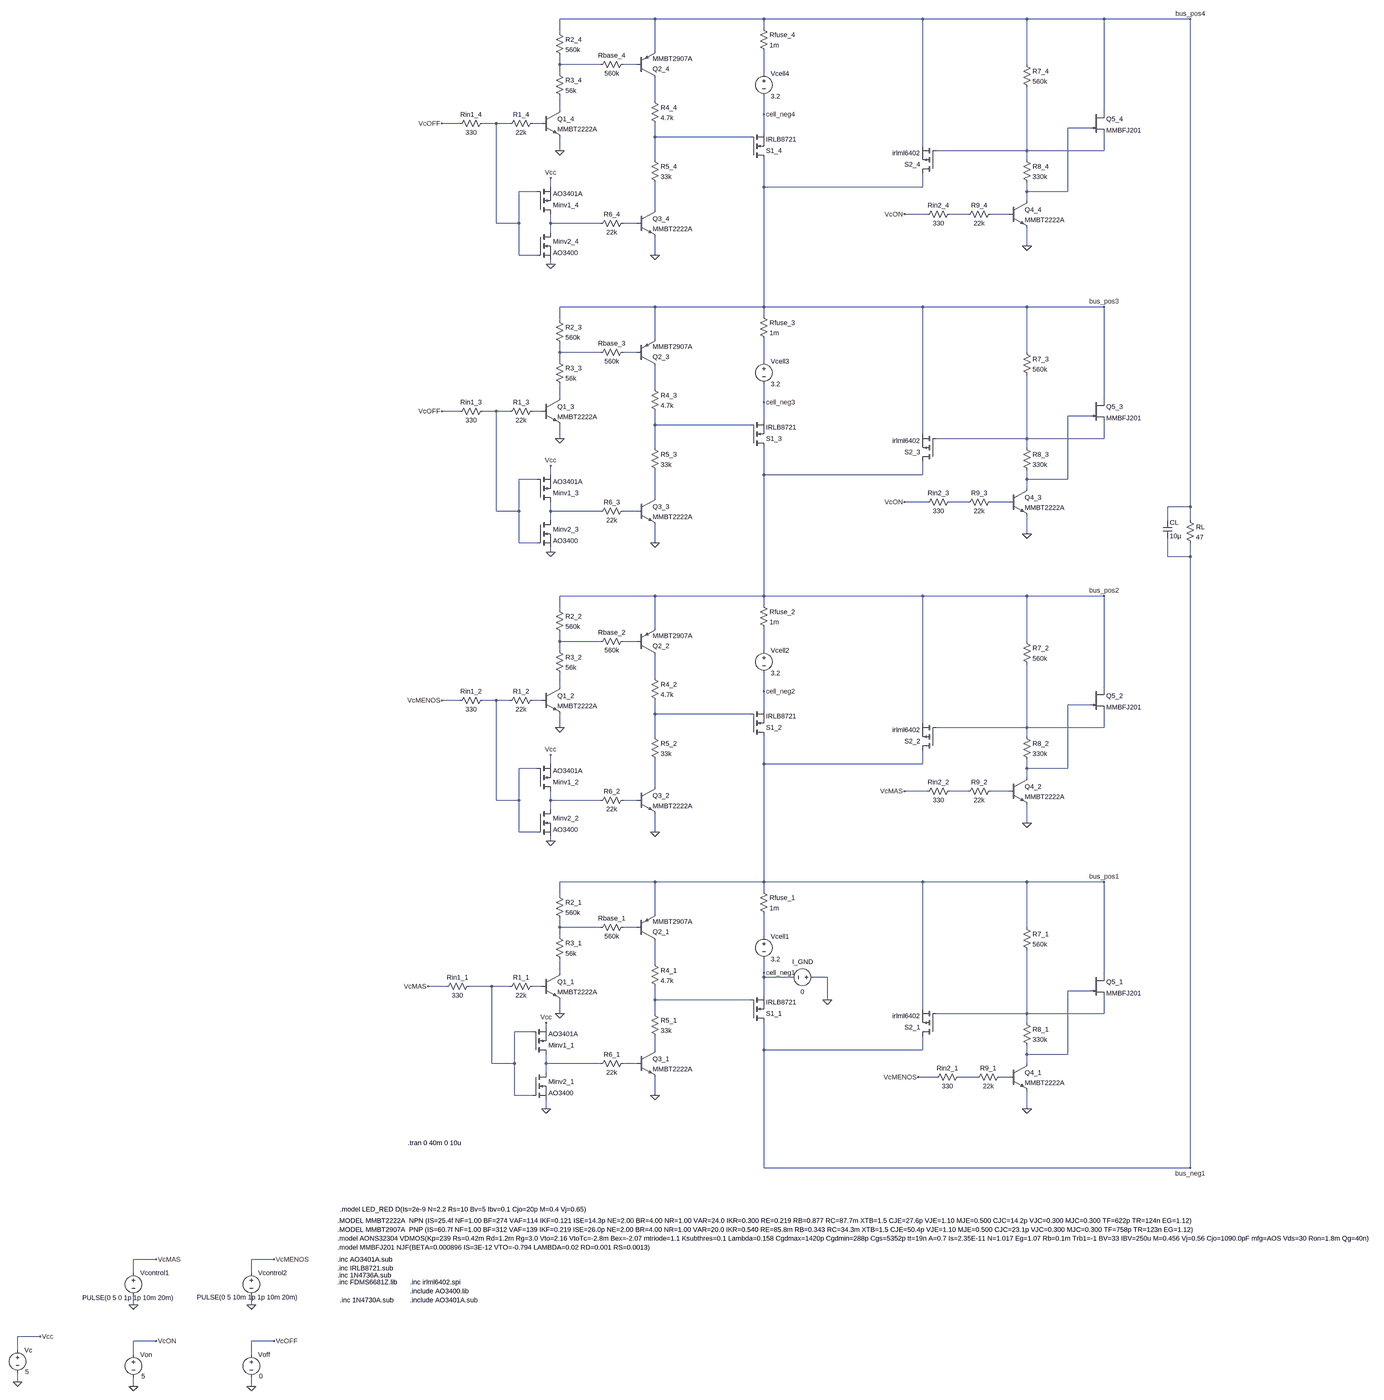
[diagram p0: schematic Pruebas aumentar cell_neg.asc, whole sheet]
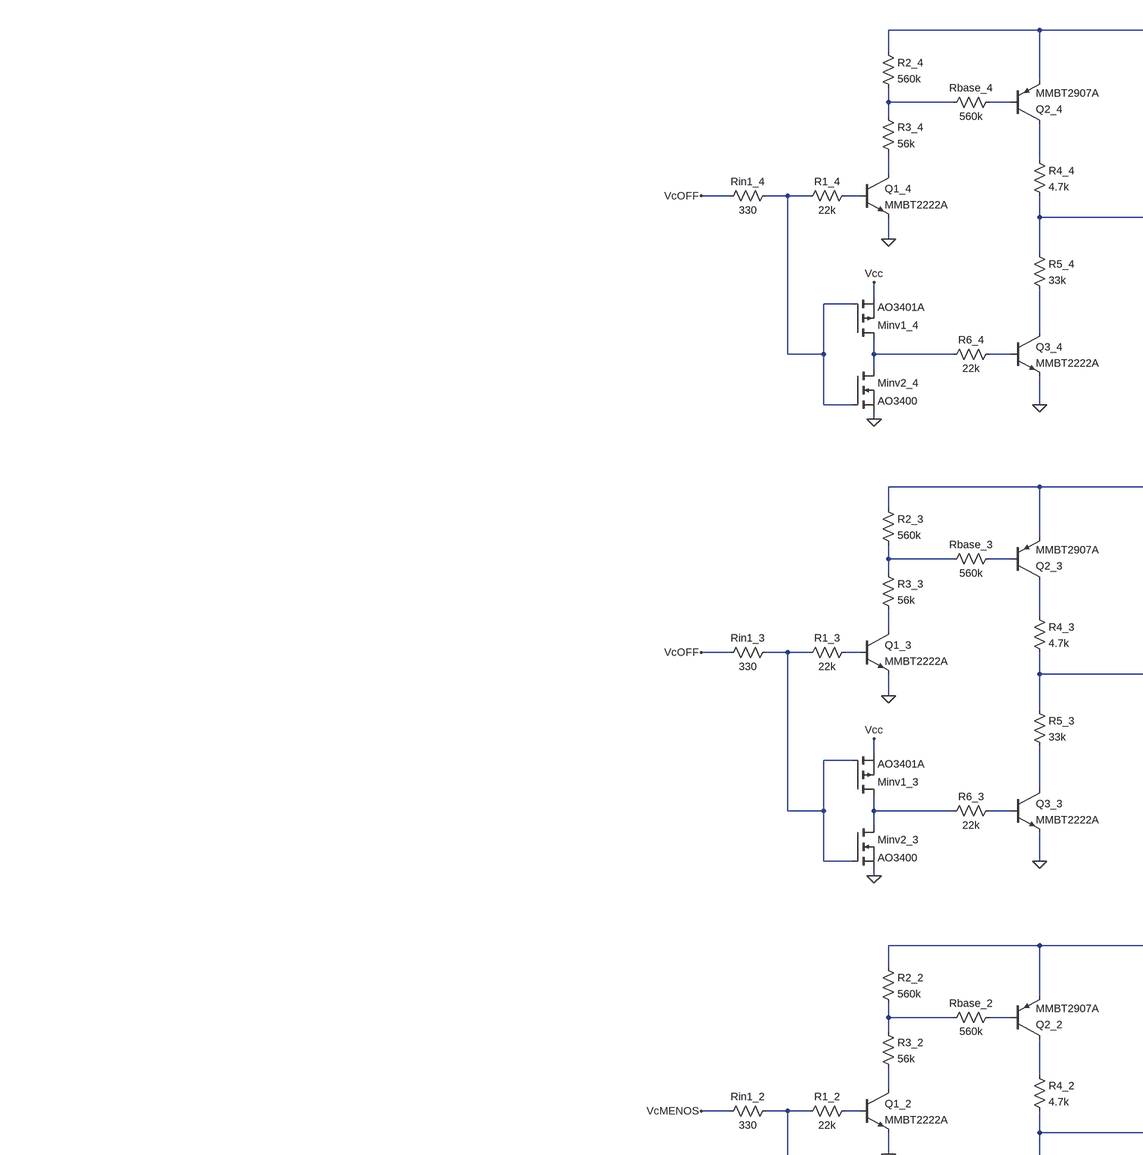
[diagram p1: schematic Pruebas aumentar cell_neg.asc, part, row 1 of 2, column 1 of 2]
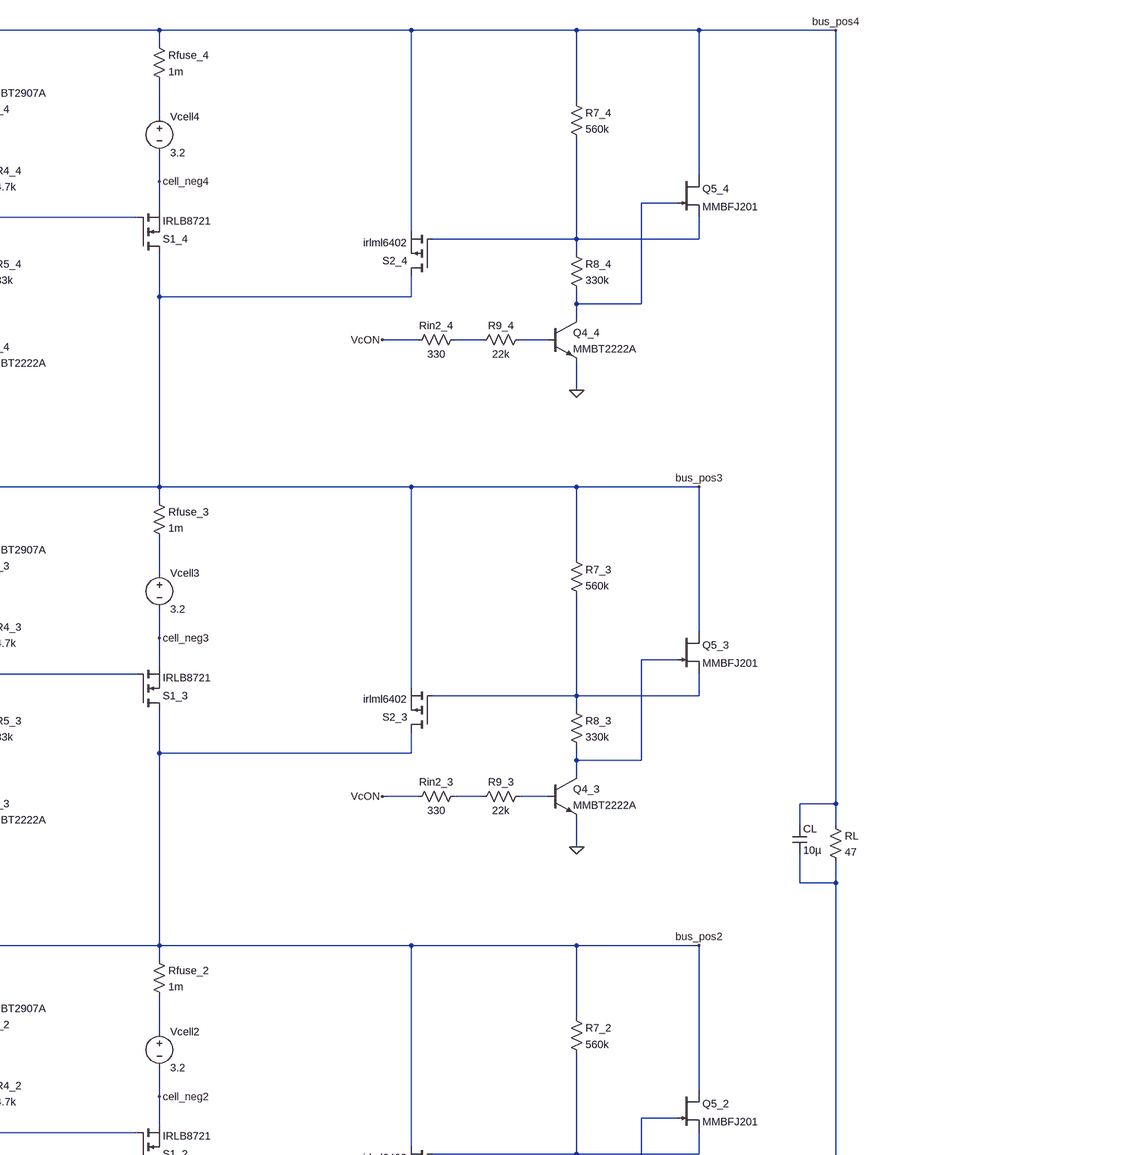
[diagram p2: schematic Pruebas aumentar cell_neg.asc, part, row 1 of 2, column 2 of 2]
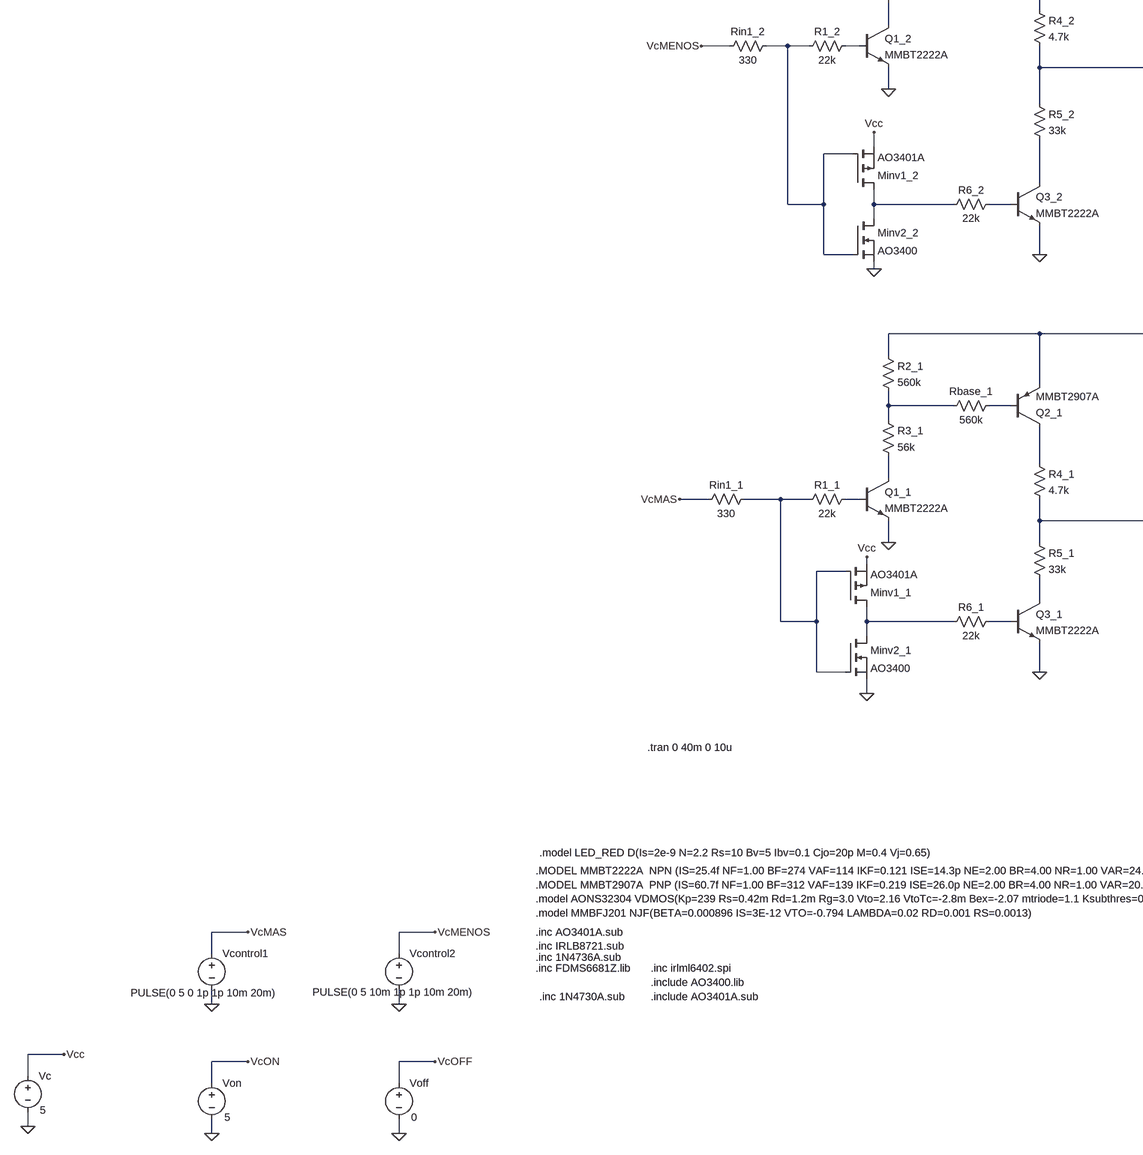
[diagram p3: schematic Pruebas aumentar cell_neg.asc, part, row 2 of 2, column 1 of 2]
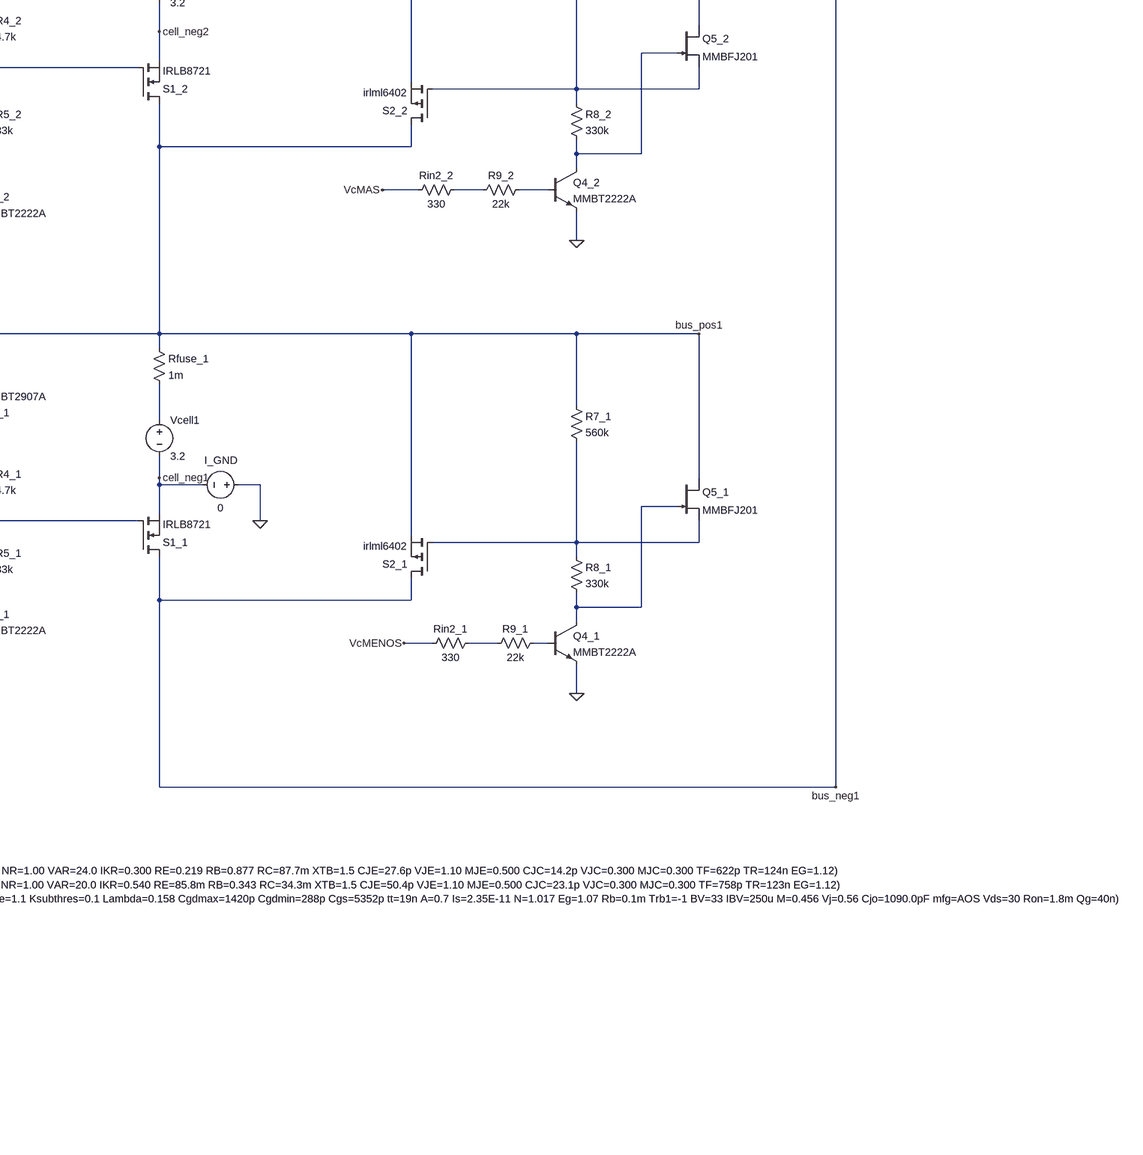
[diagram p4: schematic Pruebas aumentar cell_neg.asc, part, row 2 of 2, column 2 of 2]
Pruebas aumentar cell_neg.asc, the LTspice schematic file:
Version 4.1
SHEET 1 7672 2128
WIRE 896 -3808 560 -3808
WIRE 1280 -3808 896 -3808
WIRE 1840 -3808 1280 -3808
WIRE 2208 -3808 1840 -3808
WIRE 2480 -3808 2208 -3808
WIRE 2784 -3808 2480 -3808
WIRE 1280 -3776 1280 -3808
WIRE 560 -3760 560 -3808
WIRE 896 -3696 896 -3808
WIRE 560 -3648 560 -3680
WIRE 704 -3648 560 -3648
WIRE 832 -3648 784 -3648
WIRE 2208 -3648 2208 -3808
WIRE 560 -3616 560 -3648
WIRE 1280 -3616 1280 -3696
WIRE 896 -3520 896 -3600
WIRE 560 -3488 560 -3536
WIRE 2480 -3488 2480 -3808
WIRE 1280 -3472 1280 -3536
WIRE 208 -3440 144 -3440
WIRE 336 -3440 288 -3440
WIRE 384 -3440 336 -3440
WIRE 496 -3440 464 -3440
WIRE 2432 -3424 2352 -3424
WIRE 1280 -3408 1280 -3472
WIRE 896 -3392 896 -3440
WIRE 1232 -3392 896 -3392
WIRE 1840 -3360 1840 -3808
WIRE 560 -3344 560 -3392
WIRE 2208 -3344 2208 -3568
WIRE 2208 -3344 1888 -3344
WIRE 2480 -3344 2480 -3392
WIRE 2480 -3344 2208 -3344
WIRE 896 -3312 896 -3392
WIRE 2208 -3312 2208 -3344
WIRE 528 -3216 528 -3248
WIRE 1280 -3216 1280 -3312
WIRE 1840 -3216 1840 -3264
WIRE 1840 -3216 1280 -3216
WIRE 480 -3200 416 -3200
WIRE 2208 -3200 2208 -3232
WIRE 2352 -3200 2352 -3424
WIRE 2352 -3200 2208 -3200
WIRE 2208 -3168 2208 -3200
WIRE 896 -3136 896 -3232
WIRE 1856 -3120 1776 -3120
WIRE 2000 -3120 1936 -3120
WIRE 2144 -3120 2080 -3120
WIRE 336 -3088 336 -3440
WIRE 416 -3088 416 -3200
WIRE 416 -3088 336 -3088
WIRE 528 -3088 528 -3120
WIRE 704 -3088 528 -3088
WIRE 832 -3088 784 -3088
WIRE 528 -3056 528 -3088
WIRE 2208 -3008 2208 -3072
WIRE 416 -2976 416 -3088
WIRE 480 -2976 416 -2976
WIRE 896 -2976 896 -3040
WIRE 528 -2944 528 -2960
WIRE 896 -2720 560 -2720
WIRE 1280 -2720 1280 -3216
WIRE 1280 -2720 896 -2720
WIRE 1840 -2720 1280 -2720
WIRE 2208 -2720 1840 -2720
WIRE 2480 -2720 2208 -2720
WIRE 1280 -2688 1280 -2720
WIRE 560 -2672 560 -2720
WIRE 896 -2608 896 -2720
WIRE 560 -2560 560 -2592
WIRE 704 -2560 560 -2560
WIRE 832 -2560 784 -2560
WIRE 2208 -2560 2208 -2720
WIRE 560 -2528 560 -2560
WIRE 1280 -2528 1280 -2608
WIRE 896 -2432 896 -2512
WIRE 560 -2400 560 -2448
WIRE 2480 -2400 2480 -2720
WIRE 1280 -2384 1280 -2448
WIRE 208 -2352 144 -2352
WIRE 336 -2352 288 -2352
WIRE 384 -2352 336 -2352
WIRE 496 -2352 464 -2352
WIRE 2432 -2336 2352 -2336
WIRE 1280 -2320 1280 -2384
WIRE 896 -2304 896 -2352
WIRE 1232 -2304 896 -2304
WIRE 1840 -2272 1840 -2720
WIRE 560 -2256 560 -2304
WIRE 2208 -2256 2208 -2480
WIRE 2208 -2256 1888 -2256
WIRE 2480 -2256 2480 -2304
WIRE 2480 -2256 2208 -2256
WIRE 896 -2224 896 -2304
WIRE 2208 -2224 2208 -2256
WIRE 528 -2128 528 -2160
WIRE 1280 -2128 1280 -2224
WIRE 1840 -2128 1840 -2176
WIRE 1840 -2128 1280 -2128
WIRE 480 -2112 416 -2112
WIRE 2208 -2112 2208 -2144
WIRE 2352 -2112 2352 -2336
WIRE 2352 -2112 2208 -2112
WIRE 2208 -2080 2208 -2112
WIRE 896 -2048 896 -2144
WIRE 1856 -2032 1776 -2032
WIRE 2000 -2032 1936 -2032
WIRE 2144 -2032 2080 -2032
WIRE 2784 -2016 2784 -3808
WIRE 2784 -2016 2704 -2016
WIRE 336 -2000 336 -2352
WIRE 416 -2000 416 -2112
WIRE 416 -2000 336 -2000
WIRE 528 -2000 528 -2032
WIRE 704 -2000 528 -2000
WIRE 832 -2000 784 -2000
WIRE 528 -1968 528 -2000
WIRE 2704 -1968 2704 -2016
WIRE 2784 -1968 2784 -2016
WIRE 2208 -1920 2208 -1984
WIRE 416 -1888 416 -2000
WIRE 480 -1888 416 -1888
WIRE 896 -1888 896 -1952
WIRE 528 -1856 528 -1872
WIRE 2704 -1840 2704 -1904
WIRE 2784 -1840 2784 -1888
WIRE 2784 -1840 2704 -1840
WIRE 896 -1696 560 -1696
WIRE 1280 -1696 1280 -2128
WIRE 1280 -1696 896 -1696
WIRE 1840 -1696 1280 -1696
WIRE 2208 -1696 1840 -1696
WIRE 2480 -1696 2208 -1696
WIRE 1280 -1664 1280 -1696
WIRE 560 -1648 560 -1696
WIRE 896 -1584 896 -1696
WIRE 560 -1536 560 -1568
WIRE 704 -1536 560 -1536
WIRE 832 -1536 784 -1536
WIRE 2208 -1536 2208 -1696
WIRE 560 -1504 560 -1536
WIRE 1280 -1504 1280 -1584
WIRE 896 -1408 896 -1488
WIRE 560 -1376 560 -1424
WIRE 2480 -1376 2480 -1696
WIRE 1280 -1360 1280 -1424
WIRE 208 -1328 144 -1328
WIRE 336 -1328 288 -1328
WIRE 384 -1328 336 -1328
WIRE 496 -1328 464 -1328
WIRE 2432 -1312 2352 -1312
WIRE 1280 -1296 1280 -1360
WIRE 896 -1280 896 -1328
WIRE 1232 -1280 896 -1280
WIRE 1840 -1248 1840 -1696
WIRE 560 -1232 560 -1280
WIRE 2208 -1232 2208 -1456
WIRE 2208 -1232 1888 -1232
WIRE 2480 -1232 2480 -1280
WIRE 2480 -1232 2208 -1232
WIRE 896 -1200 896 -1280
WIRE 2208 -1200 2208 -1232
WIRE 528 -1104 528 -1136
WIRE 1280 -1104 1280 -1200
WIRE 1840 -1104 1840 -1152
WIRE 1840 -1104 1280 -1104
WIRE 480 -1088 416 -1088
WIRE 2208 -1088 2208 -1120
WIRE 2352 -1088 2352 -1312
WIRE 2352 -1088 2208 -1088
WIRE 2208 -1056 2208 -1088
WIRE 896 -1024 896 -1120
WIRE 1856 -1008 1776 -1008
WIRE 2000 -1008 1936 -1008
WIRE 2144 -1008 2080 -1008
WIRE 336 -976 336 -1328
WIRE 416 -976 416 -1088
WIRE 416 -976 336 -976
WIRE 528 -976 528 -1008
WIRE 704 -976 528 -976
WIRE 832 -976 784 -976
WIRE 528 -944 528 -976
WIRE 2208 -896 2208 -960
WIRE 416 -864 416 -976
WIRE 480 -864 416 -864
WIRE 896 -864 896 -928
WIRE 528 -832 528 -848
WIRE 896 -688 560 -688
WIRE 1280 -688 1280 -1104
WIRE 1280 -688 896 -688
WIRE 1840 -688 1280 -688
WIRE 2208 -688 1840 -688
WIRE 2480 -688 2208 -688
WIRE 1280 -656 1280 -688
WIRE 560 -640 560 -688
WIRE 896 -576 896 -688
WIRE 560 -528 560 -560
WIRE 704 -528 560 -528
WIRE 832 -528 784 -528
WIRE 2208 -528 2208 -688
WIRE 560 -496 560 -528
WIRE 1280 -496 1280 -576
WIRE 896 -400 896 -480
WIRE 560 -368 560 -416
WIRE 1280 -368 1280 -416
WIRE 2480 -368 2480 -688
WIRE 1280 -352 1280 -368
WIRE 1376 -352 1280 -352
WIRE 1504 -352 1456 -352
WIRE 160 -320 96 -320
WIRE 320 -320 240 -320
WIRE 384 -320 320 -320
WIRE 496 -320 464 -320
WIRE 2432 -304 2352 -304
WIRE 1280 -288 1280 -352
WIRE 896 -272 896 -320
WIRE 1232 -272 896 -272
WIRE 1504 -272 1504 -352
WIRE 1840 -240 1840 -688
WIRE 560 -224 560 -272
WIRE 896 -224 896 -272
WIRE 2208 -224 2208 -448
WIRE 2208 -224 1888 -224
WIRE 2480 -224 2480 -272
WIRE 2480 -224 2208 -224
WIRE 2208 -192 2208 -224
WIRE 512 -176 512 -192
WIRE 464 -160 400 -160
WIRE 896 -96 896 -144
WIRE 1280 -96 1280 -192
WIRE 1840 -96 1840 -144
WIRE 1840 -96 1280 -96
WIRE 2208 -80 2208 -112
WIRE 2352 -80 2352 -304
WIRE 2352 -80 2208 -80
WIRE 320 -48 320 -320
WIRE 400 -48 400 -160
WIRE 400 -48 320 -48
WIRE 512 -48 512 -80
WIRE 704 -48 512 -48
WIRE 832 -48 784 -48
WIRE 2208 -48 2208 -80
WIRE 512 -16 512 -48
WIRE 1888 0 1824 0
WIRE 2032 0 1968 0
WIRE 2144 0 2112 0
WIRE 400 64 400 -48
WIRE 464 64 400 64
WIRE 896 64 896 0
WIRE 512 112 512 80
WIRE 2208 112 2208 48
WIRE 1280 320 1280 -96
WIRE 2784 320 2784 -1840
WIRE 2784 320 1280 320
WIRE -1072 1024 -1152 1024
WIRE -656 1024 -736 1024
WIRE -1152 1072 -1152 1024
WIRE -736 1072 -736 1024
WIRE -1152 1184 -1152 1152
WIRE -736 1184 -736 1152
WIRE -1504 1296 -1584 1296
WIRE -1072 1312 -1152 1312
WIRE -656 1312 -736 1312
WIRE -1584 1344 -1584 1296
WIRE -1152 1360 -1152 1312
WIRE -736 1360 -736 1312
WIRE -1584 1456 -1584 1424
WIRE -1152 1472 -1152 1440
WIRE -736 1472 -736 1440
FLAG 560 -224 0
FLAG 896 64 0
FLAG -1152 1184 0
FLAG -736 1184 0
FLAG -1072 1024 VcMAS
FLAG -656 1024 VcMENOS
FLAG -736 1472 0
FLAG -656 1312 VcOFF
FLAG -1152 1472 0
FLAG -1072 1312 VcON
FLAG 96 -320 VcMAS
FLAG 2208 112 0
FLAG 1824 0 VcMENOS
FLAG -1584 1456 0
FLAG -1504 1296 Vcc
FLAG 512 112 0
FLAG 512 -192 Vcc
FLAG 1504 -272 0
FLAG 560 -1232 0
FLAG 896 -864 0
FLAG 144 -1328 VcMENOS
FLAG 2208 -896 0
FLAG 1776 -1008 VcMAS
FLAG 528 -832 0
FLAG 528 -1136 Vcc
FLAG 2480 -1696 bus_pos2
FLAG 2784 320 bus_neg1
FLAG 1280 -368 cell_neg1
FLAG 1280 -1360 cell_neg2
FLAG 2480 -688 bus_pos1
FLAG 560 -2256 0
FLAG 896 -1888 0
FLAG 144 -2352 VcOFF
FLAG 2208 -1920 0
FLAG 1776 -2032 VcON
FLAG 528 -1856 0
FLAG 528 -2160 Vcc
FLAG 1280 -2384 cell_neg3
FLAG 560 -3344 0
FLAG 896 -2976 0
FLAG 144 -3440 VcOFF
FLAG 2208 -3008 0
FLAG 1776 -3120 VcON
FLAG 528 -2944 0
FLAG 528 -3248 Vcc
FLAG 1280 -3472 cell_neg4
FLAG 2480 -2720 bus_pos3
FLAG 2784 -3808 bus_pos4
SYMBOL npn 832 -96 R0
SYMATTR InstName Q3_1
SYMATTR Value MMBT2222A
SYMBOL res 880 -240 R0
SYMATTR InstName R5_1
SYMATTR Value 33k
SYMBOL res 880 -416 R0
SYMATTR InstName R4_1
SYMATTR Value 4.7k
SYMBOL npn 496 -368 R0
SYMATTR InstName Q1_1
SYMATTR Value MMBT2222A
SYMBOL res 544 -512 R0
SYMATTR InstName R3_1
SYMATTR Value 56k
SYMBOL res 544 -656 R0
SYMATTR InstName R2_1
SYMATTR Value 560k
SYMBOL res 800 -64 R90
WINDOW 0 0 56 VBottom 2
WINDOW 3 32 56 VTop 2
SYMATTR InstName R6_1
SYMATTR Value 22k
SYMBOL voltage 1280 -512 R0
WINDOW 123 0 0 Left 0
WINDOW 39 0 0 Left 0
SYMATTR InstName Vcell1
SYMATTR Value 3.2
SYMBOL pnp 832 -480 M180
SYMATTR InstName Q2_1
SYMATTR Value MMBT2907A
SYMBOL nmos 1232 -192 M180
SYMATTR InstName S1_1
SYMATTR Value IRLB8721
SYMATTR Prefix X
SYMBOL voltage -1152 1056 R0
WINDOW 3 -180 103 Left 2
WINDOW 123 0 0 Left 0
WINDOW 39 0 0 Left 0
SYMATTR Value PULSE(0 5 0 1p 1p 10m 20m)
SYMATTR InstName Vcontrol1
SYMBOL voltage -736 1056 R0
WINDOW 3 -192 102 Left 2
WINDOW 123 0 0 Left 0
WINDOW 39 0 0 Left 0
SYMATTR Value PULSE(0 5 10m 1p 1p 10m 20m)
SYMATTR InstName Vcontrol2
SYMBOL voltage -736 1344 R0
WINDOW 3 27 92 Left 2
WINDOW 123 0 0 Left 0
WINDOW 39 0 0 Left 0
SYMATTR Value 0
SYMATTR InstName Voff
SYMBOL voltage -1152 1344 R0
WINDOW 3 28 92 Left 2
WINDOW 123 0 0 Left 0
WINDOW 39 0 0 Left 0
SYMATTR Value 5
SYMATTR InstName Von
SYMBOL res 480 -336 R90
WINDOW 0 0 56 VBottom 2
WINDOW 3 32 56 VTop 2
SYMATTR InstName R1_1
SYMATTR Value 22k
SYMBOL res 1264 -672 R0
SYMATTR InstName Rfuse_1
SYMATTR Value 1m
SYMBOL npn 2144 -48 R0
SYMATTR InstName Q4_1
SYMATTR Value MMBT2222A
SYMBOL res 2128 -16 R90
WINDOW 0 0 56 VBottom 2
WINDOW 3 32 56 VTop 2
SYMATTR InstName R9_1
SYMATTR Value 22k
SYMBOL res 2192 -544 R0
SYMATTR InstName R7_1
SYMATTR Value 560k
SYMBOL pmos 1888 -144 R180
SYMATTR InstName S2_1
SYMATTR Value irlml6402
SYMATTR Prefix X
SYMBOL res 2192 -208 R0
SYMATTR InstName R8_1
SYMATTR Value 330k
SYMBOL res 2768 -1984 R0
SYMATTR InstName RL
SYMATTR Value 47
SYMBOL voltage -1584 1328 R0
WINDOW 3 27 92 Left 2
WINDOW 123 0 0 Left 0
WINDOW 39 0 0 Left 0
SYMATTR Value 5
SYMATTR InstName Vc
SYMBOL pmos 464 -80 M180
SYMATTR InstName Minv1_1
SYMATTR Value AO3401A
SYMATTR Prefix X
SYMBOL nmos 464 -16 R0
SYMATTR InstName Minv2_1
SYMATTR Value AO3400
SYMATTR Prefix X
SYMBOL njf 2432 -368 R0
SYMATTR InstName Q5_1
SYMATTR Value MMBFJ201
SYMBOL npn 832 -1024 R0
SYMATTR InstName Q3_2
SYMATTR Value MMBT2222A
SYMBOL res 880 -1216 R0
SYMATTR InstName R5_2
SYMATTR Value 33k
SYMBOL res 880 -1424 R0
SYMATTR InstName R4_2
SYMATTR Value 4.7k
SYMBOL npn 496 -1376 R0
SYMATTR InstName Q1_2
SYMATTR Value MMBT2222A
SYMBOL res 544 -1520 R0
SYMATTR InstName R3_2
SYMATTR Value 56k
SYMBOL res 544 -1664 R0
SYMATTR InstName R2_2
SYMATTR Value 560k
SYMBOL res 800 -992 R90
WINDOW 0 0 56 VBottom 2
WINDOW 3 32 56 VTop 2
SYMATTR InstName R6_2
SYMATTR Value 22k
SYMBOL voltage 1280 -1520 R0
WINDOW 123 0 0 Left 0
WINDOW 39 0 0 Left 0
SYMATTR InstName Vcell2
SYMATTR Value 3.2
SYMBOL pnp 832 -1488 M180
SYMATTR InstName Q2_2
SYMATTR Value MMBT2907A
SYMBOL nmos 1232 -1200 M180
SYMATTR InstName S1_2
SYMATTR Value IRLB8721
SYMATTR Prefix X
SYMBOL res 480 -1344 R90
WINDOW 0 0 56 VBottom 2
WINDOW 3 32 56 VTop 2
SYMATTR InstName R1_2
SYMATTR Value 22k
SYMBOL res 1264 -1680 R0
SYMATTR InstName Rfuse_2
SYMATTR Value 1m
SYMBOL npn 2144 -1056 R0
SYMATTR InstName Q4_2
SYMATTR Value MMBT2222A
SYMBOL res 2096 -1024 R90
WINDOW 0 0 56 VBottom 2
WINDOW 3 32 56 VTop 2
SYMATTR InstName R9_2
SYMATTR Value 22k
SYMBOL res 2192 -1552 R0
SYMATTR InstName R7_2
SYMATTR Value 560k
SYMBOL pmos 1888 -1152 R180
SYMATTR InstName S2_2
SYMATTR Value irlml6402
SYMATTR Prefix X
SYMBOL res 2192 -1216 R0
SYMATTR InstName R8_2
SYMATTR Value 330k
SYMBOL pmos 480 -1008 M180
SYMATTR InstName Minv1_2
SYMATTR Value AO3401A
SYMATTR Prefix X
SYMBOL nmos 480 -944 R0
SYMATTR InstName Minv2_2
SYMATTR Value AO3400
SYMATTR Prefix X
SYMBOL njf 2432 -1376 R0
SYMATTR InstName Q5_2
SYMATTR Value MMBFJ201
SYMBOL res 256 -336 R90
WINDOW 0 0 56 VBottom 2
WINDOW 3 32 56 VTop 2
SYMATTR InstName Rin1_1
SYMATTR Value 330
SYMBOL res 304 -1344 R90
WINDOW 0 0 56 VBottom 2
WINDOW 3 32 56 VTop 2
SYMATTR InstName Rin1_2
SYMATTR Value 330
SYMBOL res 1984 -16 R90
WINDOW 0 0 56 VBottom 2
WINDOW 3 32 56 VTop 2
SYMATTR InstName Rin2_1
SYMATTR Value 330
SYMBOL res 1952 -1024 R90
WINDOW 0 0 56 VBottom 2
WINDOW 3 32 56 VTop 2
SYMATTR InstName Rin2_2
SYMATTR Value 330
SYMBOL res 800 -1552 R90
WINDOW 0 0 56 VBottom 2
WINDOW 3 32 56 VTop 2
SYMATTR InstName Rbase_2
SYMATTR Value 560k
SYMBOL res 800 -544 R90
WINDOW 0 0 56 VBottom 2
WINDOW 3 32 56 VTop 2
SYMATTR InstName Rbase_1
SYMATTR Value 560k
SYMBOL npn 832 -2048 R0
SYMATTR InstName Q3_3
SYMATTR Value MMBT2222A
SYMBOL res 880 -2240 R0
SYMATTR InstName R5_3
SYMATTR Value 33k
SYMBOL res 880 -2448 R0
SYMATTR InstName R4_3
SYMATTR Value 4.7k
SYMBOL npn 496 -2400 R0
SYMATTR InstName Q1_3
SYMATTR Value MMBT2222A
SYMBOL res 544 -2544 R0
SYMATTR InstName R3_3
SYMATTR Value 56k
SYMBOL res 544 -2688 R0
SYMATTR InstName R2_3
SYMATTR Value 560k
SYMBOL res 800 -2016 R90
WINDOW 0 0 56 VBottom 2
WINDOW 3 32 56 VTop 2
SYMATTR InstName R6_3
SYMATTR Value 22k
SYMBOL voltage 1280 -2544 R0
WINDOW 123 0 0 Left 0
WINDOW 39 0 0 Left 0
SYMATTR InstName Vcell3
SYMATTR Value 3.2
SYMBOL pnp 832 -2512 M180
SYMATTR InstName Q2_3
SYMATTR Value MMBT2907A
SYMBOL nmos 1232 -2224 M180
SYMATTR InstName S1_3
SYMATTR Value IRLB8721
SYMATTR Prefix X
SYMBOL res 480 -2368 R90
WINDOW 0 0 56 VBottom 2
WINDOW 3 32 56 VTop 2
SYMATTR InstName R1_3
SYMATTR Value 22k
SYMBOL res 1264 -2704 R0
SYMATTR InstName Rfuse_3
SYMATTR Value 1m
SYMBOL npn 2144 -2080 R0
SYMATTR InstName Q4_3
SYMATTR Value MMBT2222A
SYMBOL res 2096 -2048 R90
WINDOW 0 0 56 VBottom 2
WINDOW 3 32 56 VTop 2
SYMATTR InstName R9_3
SYMATTR Value 22k
SYMBOL res 2192 -2576 R0
SYMATTR InstName R7_3
SYMATTR Value 560k
SYMBOL pmos 1888 -2176 R180
SYMATTR InstName S2_3
SYMATTR Value irlml6402
SYMATTR Prefix X
SYMBOL res 2192 -2240 R0
SYMATTR InstName R8_3
SYMATTR Value 330k
SYMBOL pmos 480 -2032 M180
SYMATTR InstName Minv1_3
SYMATTR Value AO3401A
SYMATTR Prefix X
SYMBOL nmos 480 -1968 R0
SYMATTR InstName Minv2_3
SYMATTR Value AO3400
SYMATTR Prefix X
SYMBOL njf 2432 -2400 R0
SYMATTR InstName Q5_3
SYMATTR Value MMBFJ201
SYMBOL res 304 -2368 R90
WINDOW 0 0 56 VBottom 2
WINDOW 3 32 56 VTop 2
SYMATTR InstName Rin1_3
SYMATTR Value 330
SYMBOL res 1952 -2048 R90
WINDOW 0 0 56 VBottom 2
WINDOW 3 32 56 VTop 2
SYMATTR InstName Rin2_3
SYMATTR Value 330
SYMBOL res 800 -2576 R90
WINDOW 0 0 56 VBottom 2
WINDOW 3 32 56 VTop 2
SYMATTR InstName Rbase_3
SYMATTR Value 560k
SYMBOL npn 832 -3136 R0
SYMATTR InstName Q3_4
SYMATTR Value MMBT2222A
SYMBOL res 880 -3328 R0
SYMATTR InstName R5_4
SYMATTR Value 33k
SYMBOL res 880 -3536 R0
SYMATTR InstName R4_4
SYMATTR Value 4.7k
SYMBOL npn 496 -3488 R0
SYMATTR InstName Q1_4
SYMATTR Value MMBT2222A
SYMBOL res 544 -3632 R0
SYMATTR InstName R3_4
SYMATTR Value 56k
SYMBOL res 544 -3776 R0
SYMATTR InstName R2_4
SYMATTR Value 560k
SYMBOL res 800 -3104 R90
WINDOW 0 0 56 VBottom 2
WINDOW 3 32 56 VTop 2
SYMATTR InstName R6_4
SYMATTR Value 22k
SYMBOL voltage 1280 -3632 R0
WINDOW 123 0 0 Left 0
WINDOW 39 0 0 Left 0
SYMATTR InstName Vcell4
SYMATTR Value 3.2
SYMBOL pnp 832 -3600 M180
SYMATTR InstName Q2_4
SYMATTR Value MMBT2907A
SYMBOL nmos 1232 -3312 M180
SYMATTR InstName S1_4
SYMATTR Value IRLB8721
SYMATTR Prefix X
SYMBOL res 480 -3456 R90
WINDOW 0 0 56 VBottom 2
WINDOW 3 32 56 VTop 2
SYMATTR InstName R1_4
SYMATTR Value 22k
SYMBOL res 1264 -3792 R0
SYMATTR InstName Rfuse_4
SYMATTR Value 1m
SYMBOL npn 2144 -3168 R0
SYMATTR InstName Q4_4
SYMATTR Value MMBT2222A
SYMBOL res 2096 -3136 R90
WINDOW 0 0 56 VBottom 2
WINDOW 3 32 56 VTop 2
SYMATTR InstName R9_4
SYMATTR Value 22k
SYMBOL res 2192 -3664 R0
SYMATTR InstName R7_4
SYMATTR Value 560k
SYMBOL pmos 1888 -3264 R180
SYMATTR InstName S2_4
SYMATTR Value irlml6402
SYMATTR Prefix X
SYMBOL res 2192 -3328 R0
SYMATTR InstName R8_4
SYMATTR Value 330k
SYMBOL pmos 480 -3120 M180
SYMATTR InstName Minv1_4
SYMATTR Value AO3401A
SYMATTR Prefix X
SYMBOL nmos 480 -3056 R0
SYMATTR InstName Minv2_4
SYMATTR Value AO3400
SYMATTR Prefix X
SYMBOL njf 2432 -3488 R0
SYMATTR InstName Q5_4
SYMATTR Value MMBFJ201
SYMBOL res 304 -3456 R90
WINDOW 0 0 56 VBottom 2
WINDOW 3 32 56 VTop 2
SYMATTR InstName Rin1_4
SYMATTR Value 330
SYMBOL res 1952 -3136 R90
WINDOW 0 0 56 VBottom 2
WINDOW 3 32 56 VTop 2
SYMATTR InstName Rin2_4
SYMATTR Value 330
SYMBOL res 800 -3664 R90
WINDOW 0 0 56 VBottom 2
WINDOW 3 32 56 VTop 2
SYMATTR InstName Rbase_4
SYMATTR Value 560k
SYMBOL voltage 1472 -352 M270
WINDOW 0 39 55 VTop 2
WINDOW 3 -36 56 VBottom 2
SYMATTR InstName I_GND
SYMATTR Value 0
SYMBOL cap 2688 -1968 R0
SYMATTR InstName CL
SYMATTR Value 10µ
TEXT 24 232 Left 2 !.tran 0 40m 0 10u
TEXT -224 888 Left 2 !.MODEL MMBT2222A  NPN (IS=25.4f NF=1.00 BF=274 VAF=114 IKF=0.121 ISE=14.3p NE=2.00 BR=4.00 NR=1.00 VAR=24.0 IKR=0.300 RE=0.219 RB=0.877 RC=87.7m XTB=1.5 CJE=27.6p VJE=1.10 MJE=0.500 CJC=14.2p VJC=0.300 MJC=0.300 TF=622p TR=124n EG=1.12)\n.MODEL MMBT2907A  PNP (IS=60.7f NF=1.00 BF=312 VAF=139 IKF=0.219 ISE=26.0p NE=2.00 BR=4.00 NR=1.00 VAR=20.0 IKR=0.540 RE=85.8m RB=0.343 RC=34.3m XTB=1.5 CJE=50.4p VJE=1.10 MJE=0.500 CJC=23.1p VJC=0.300 MJC=0.300 TF=758p TR=123n EG=1.12)\n.model AONS32304 VDMOS(Kp=239 Rs=0.42m Rd=1.2m Rg=3.0 Vto=2.16 VtoTc=-2.8m Bex=-2.07 mtriode=1.1 Ksubthres=0.1 Lambda=0.158 Cgdmax=1420p Cgdmin=288p Cgs=5352p tt=19n A=0.7 Is=2.35E-11 N=1.017 Eg=1.07 Rb=0.1m Trb1=-1 BV=33 IBV=250u M=0.456 Vj=0.56 Cjo=1090.0pF mfg=AOS Vds=30 Ron=1.8m Qg=40n)\n.model MMBFJ201 NJF(BETA=0.000896 IS=3E-12 VTO=-0.794 LAMBDA=0.02 RD=0.001 RS=0.0013)
TEXT -224 1024 Left 2 !.inc AO3401A.sub\n.inc IRLB8721.sub
TEXT -224 1080 Left 2 !.inc 1N4736A.sub
TEXT -224 1104 Left 2 !.inc FDMS6681Z.lib
TEXT -216 1168 Left 2 !.inc 1N4730A.sub
TEXT -216 848 Left 2 !.model LED_RED D(Is=2e-9 N=2.2 Rs=10 Bv=5 Ibv=0.1 Cjo=20p M=0.4 Vj=0.65)
TEXT 32 1104 Left 2 !.inc irlml6402.spi
TEXT 32 1136 Left 2 !.include AO3400.lib
TEXT 32 1168 Left 2 !.include AO3401A.sub

The netlist it stands for:
* Pruebas aumentar cell_neg.asc
Q3_1 N056 N058 0 0 MMBT2222A
R5_1 N054 N056 33k
R4_1 N049 N054 4.7k
Q1_1 N050 N052 0 0 MMBT2222A
R3_1 N046 N050 56k
R2_1 bus_pos1 N046 560k
R6_1 N058 N057 22k
Vcell1 N048 cell_neg1 3.2
Q2_1 N049 N047 bus_pos1 0 MMBT2907A
X§S1_1 bus_neg1 N054 cell_neg1 IRLB8721  ; pins D G S
Vcontrol1 VcMAS 0 PULSE(0 5 0 1p 1p 10m 20m)
Vcontrol2 VcMENOS 0 PULSE(0 5 10m 1p 1p 10m 20m)
Voff VcOFF 0 0
Von VcON 0 5
R1_1 N052 N051 22k
Rfuse_1 bus_pos1 N048 1m
Q4_1 N053 N060 0 0 MMBT2222A
R9_1 N060 N059 22k
R7_1 bus_pos1 N055 560k
X§S2_1 bus_neg1 N055 bus_pos1 irlml6402  ; pins D G S
R8_1 N055 N053 330k
RL bus_pos4 bus_neg1 47
Vc Vcc 0 5
X§Minv1_1 N057 N051 Vcc AO3401A  ; pins D G S
X§Minv2_1 N057 N051 0 AO3400  ; pins D G S
J§Q5_1 bus_pos1 N053 N055 MMBFJ201
Q3_2 N041 N045 0 0 MMBT2222A
R5_2 N039 N041 33k
R4_2 N034 N039 4.7k
Q1_2 N035 N037 0 0 MMBT2222A
R3_2 N031 N035 56k
R2_2 bus_pos2 N031 560k
R6_2 N045 N044 22k
Vcell2 N033 cell_neg2 3.2
Q2_2 N034 N032 bus_pos2 0 MMBT2907A
X§S1_2 bus_pos1 N039 cell_neg2 IRLB8721  ; pins D G S
R1_2 N037 N036 22k
Rfuse_2 bus_pos2 N033 1m
Q4_2 N038 N043 0 0 MMBT2222A
R9_2 N043 N042 22k
R7_2 bus_pos2 N040 560k
X§S2_2 bus_pos1 N040 bus_pos2 irlml6402  ; pins D G S
R8_2 N040 N038 330k
X§Minv1_2 N044 N036 Vcc AO3401A  ; pins D G S
X§Minv2_2 N044 N036 0 AO3400  ; pins D G S
J§Q5_2 bus_pos2 N038 N040 MMBFJ201
Rin1_1 N051 VcMAS 330
Rin1_2 N036 VcMENOS 330
Rin2_1 N059 VcMENOS 330
Rin2_2 N042 VcMAS 330
Rbase_2 N032 N031 560k
Rbase_1 N047 N046 560k
Q3_3 N026 N030 0 0 MMBT2222A
R5_3 N024 N026 33k
R4_3 N019 N024 4.7k
Q1_3 N020 N022 0 0 MMBT2222A
R3_3 N016 N020 56k
R2_3 bus_pos3 N016 560k
R6_3 N030 N029 22k
Vcell3 N018 cell_neg3 3.2
Q2_3 N019 N017 bus_pos3 0 MMBT2907A
X§S1_3 bus_pos2 N024 cell_neg3 IRLB8721  ; pins D G S
R1_3 N022 N021 22k
Rfuse_3 bus_pos3 N018 1m
Q4_3 N023 N028 0 0 MMBT2222A
R9_3 N028 N027 22k
R7_3 bus_pos3 N025 560k
X§S2_3 bus_pos2 N025 bus_pos3 irlml6402  ; pins D G S
R8_3 N025 N023 330k
X§Minv1_3 N029 N021 Vcc AO3401A  ; pins D G S
X§Minv2_3 N029 N021 0 AO3400  ; pins D G S
J§Q5_3 bus_pos3 N023 N025 MMBFJ201
Rin1_3 N021 VcOFF 330
Rin2_3 N027 VcON 330
Rbase_3 N017 N016 560k
Q3_4 N011 N015 0 0 MMBT2222A
R5_4 N009 N011 33k
R4_4 N004 N009 4.7k
Q1_4 N005 N007 0 0 MMBT2222A
R3_4 N001 N005 56k
R2_4 bus_pos4 N001 560k
R6_4 N015 N014 22k
Vcell4 N003 cell_neg4 3.2
Q2_4 N004 N002 bus_pos4 0 MMBT2907A
X§S1_4 bus_pos3 N009 cell_neg4 IRLB8721  ; pins D G S
R1_4 N007 N006 22k
Rfuse_4 bus_pos4 N003 1m
Q4_4 N008 N013 0 0 MMBT2222A
R9_4 N013 N012 22k
R7_4 bus_pos4 N010 560k
X§S2_4 bus_pos3 N010 bus_pos4 irlml6402  ; pins D G S
R8_4 N010 N008 330k
X§Minv1_4 N014 N006 Vcc AO3401A  ; pins D G S
X§Minv2_4 N014 N006 0 AO3400  ; pins D G S
J§Q5_4 bus_pos4 N008 N010 MMBFJ201
Rin1_4 N006 VcOFF 330
Rin2_4 N012 VcON 330
Rbase_4 N002 N001 560k
V§I_GND 0 cell_neg1 0
CL bus_pos4 bus_neg1 10µ
.model NPN NPN
.model PNP PNP
.lib standard.bjt
.model NJF NJF
.model PJF PJF
.lib standard.jft
.tran 0 40m 0 10u
.MODEL MMBT2222A  NPN (IS=25.4f NF=1.00 BF=274 VAF=114 IKF=0.121 ISE=14.3p NE=2.00 BR=4.00 NR=1.00 VAR=24.0 IKR=0.300 RE=0.219 RB=0.877 RC=87.7m XTB=1.5 CJE=27.6p VJE=1.10 MJE=0.500 CJC=14.2p VJC=0.300 MJC=0.300 TF=622p TR=124n EG=1.12)
.MODEL MMBT2907A  PNP (IS=60.7f NF=1.00 BF=312 VAF=139 IKF=0.219 ISE=26.0p NE=2.00 BR=4.00 NR=1.00 VAR=20.0 IKR=0.540 RE=85.8m RB=0.343 RC=34.3m XTB=1.5 CJE=50.4p VJE=1.10 MJE=0.500 CJC=23.1p VJC=0.300 MJC=0.300 TF=758p TR=123n EG=1.12)
.model AONS32304 VDMOS(Kp=239 Rs=0.42m Rd=1.2m Rg=3.0 Vto=2.16 VtoTc=-2.8m Bex=-2.07 mtriode=1.1 Ksubthres=0.1 Lambda=0.158 Cgdmax=1420p Cgdmin=288p Cgs=5352p tt=19n A=0.7 Is=2.35E-11 N=1.017 Eg=1.07 Rb=0.1m Trb1=-1 BV=33 IBV=250u M=0.456 Vj=0.56 Cjo=1090.0pF mfg=AOS Vds=30 Ron=1.8m Qg=40n)
.model MMBFJ201 NJF(BETA=0.000896 IS=3E-12 VTO=-0.794 LAMBDA=0.02 RD=0.001 RS=0.0013)
.inc AO3401A.sub
.inc IRLB8721.sub
.inc 1N4736A.sub
.inc FDMS6681Z.lib
.inc 1N4730A.sub
.model LED_RED D(Is=2e-9 N=2.2 Rs=10 Bv=5 Ibv=0.1 Cjo=20p M=0.4 Vj=0.65)
.inc irlml6402.spi
.include AO3400.lib
.include AO3401A.sub
.backanno
.end